# EAGLE design limitSwitch (EAGLE 9.6.2)
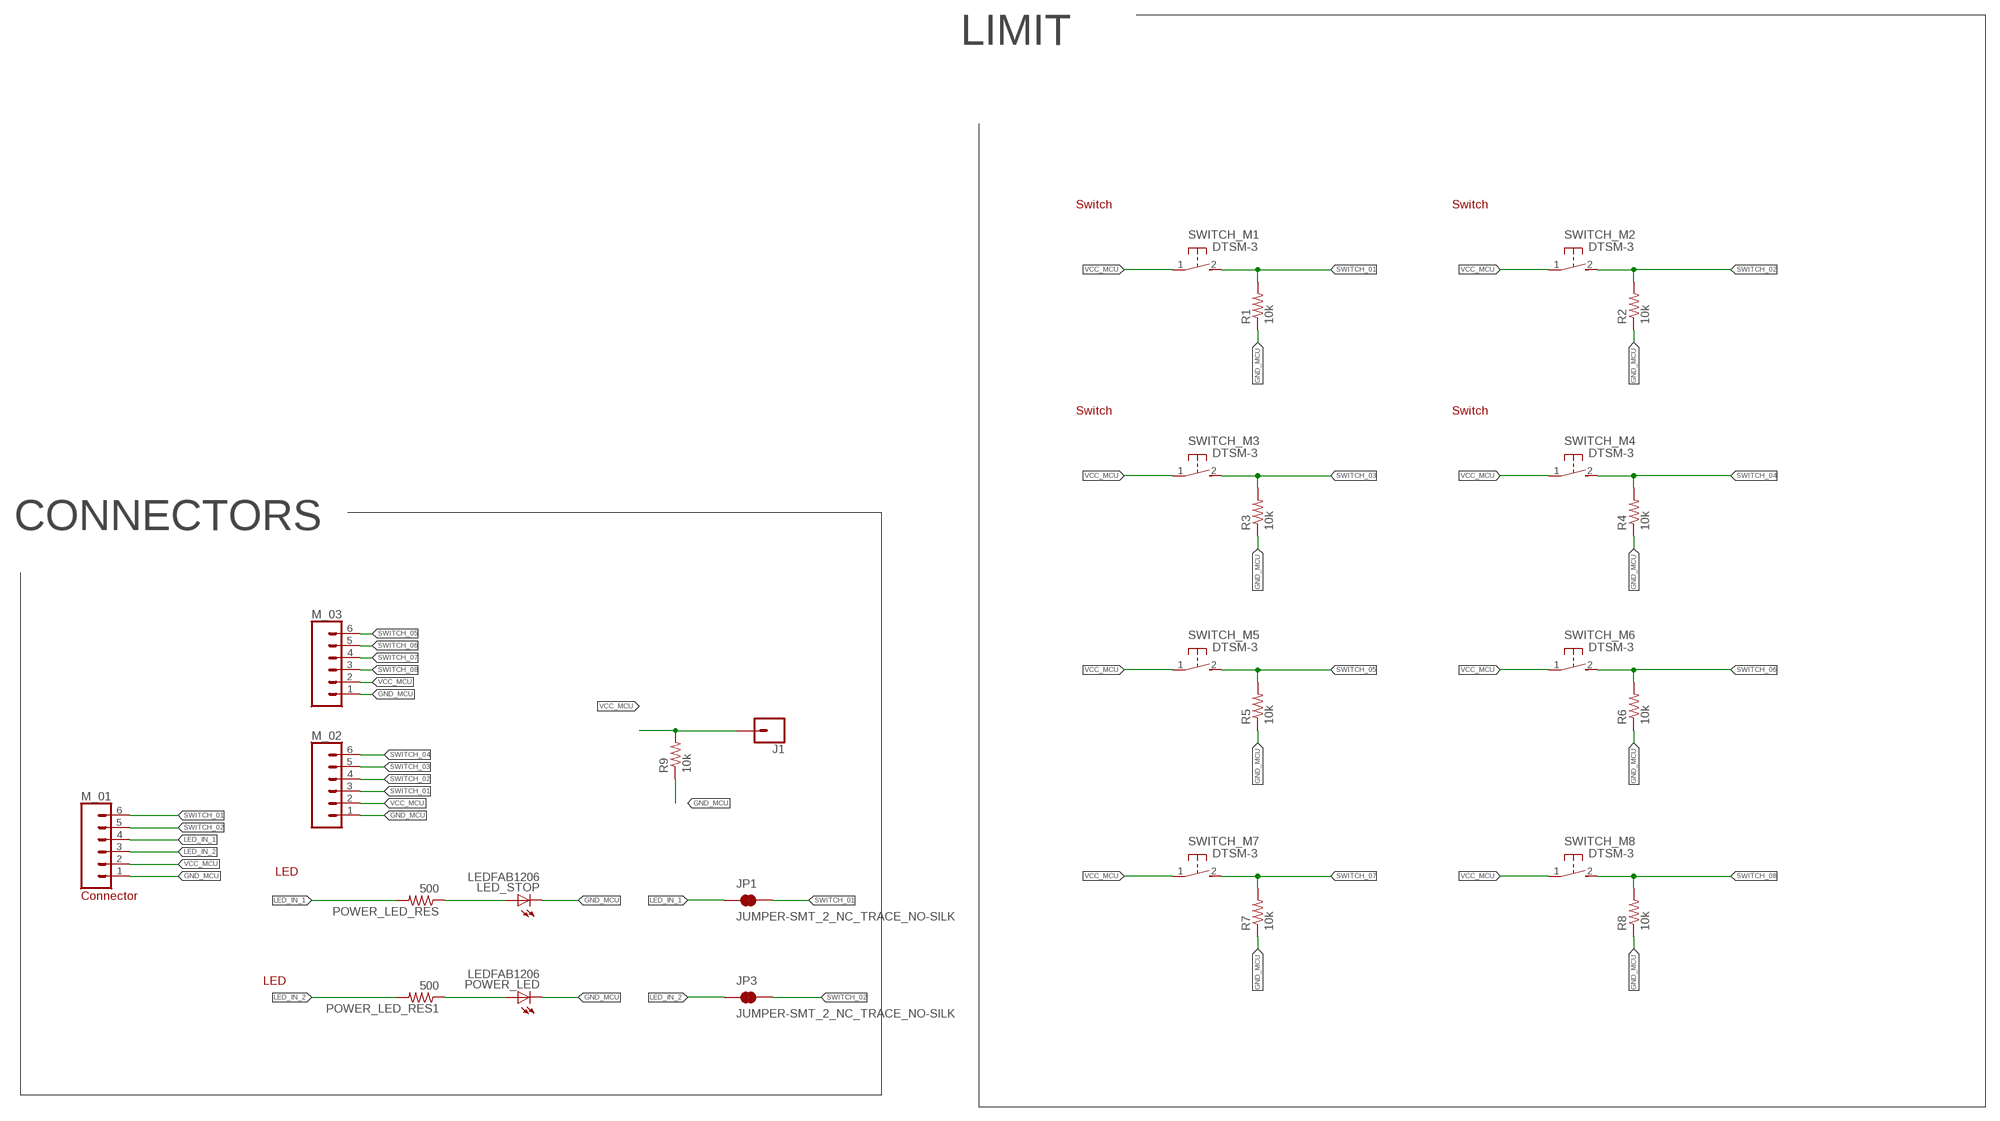
[diagram p0: schematic, sheet 1]

## Parts
J1  CONN_01  [1X01]
JP1  JUMPER-SMT_2_NC_TRACE_NO-SILK  [SMT-JUMPER_2_NC_TRACE_NO-SILK]
JP3  JUMPER-SMT_2_NC_TRACE_NO-SILK  [SMT-JUMPER_2_NC_TRACE_NO-SILK]
LED_STOP  LEDFAB1206  [LED1206FAB]
M_01  CONN_06SMD-1MM  [1X06-1MM]
M_02  CONN_06SMD-1MM  [1X06-1MM]
M_03  CONN_06SMD-1MM  [1X06-1MM]
POWER_LED  LEDFAB1206  [LED1206FAB]
POWER_LED_RES  500  R-US_M0805  [M0805]
POWER_LED_RES1  500  R-US_M0805  [M0805]
R1  10k  R-US_M0805  [M0805]
R2  10k  R-US_M0805  [M0805]
R3  10k  R-US_M0805  [M0805]
R4  10k  R-US_M0805  [M0805]
R5  10k  R-US_M0805  [M0805]
R6  10k  R-US_M0805  [M0805]
R7  10k  R-US_M0805  [M0805]
R8  10k  R-US_M0805  [M0805]
R9  10k  R-US_M0805  [M0805]
SWITCH_M1  DTSM-3  [DTSM-3]
SWITCH_M2  DTSM-3  [DTSM-3]
SWITCH_M3  DTSM-3  [DTSM-3]
SWITCH_M4  DTSM-3  [DTSM-3]
SWITCH_M5  DTSM-3  [DTSM-3]
SWITCH_M6  DTSM-3  [DTSM-3]
SWITCH_M7  DTSM-3  [DTSM-3]
SWITCH_M8  DTSM-3  [DTSM-3]

## Nets
GND_MCU: LED_STOP.2(C) M_01.1 M_02.1 M_03.1 POWER_LED.2(C) R1.1 R2.1 R3.1 R4.1 R5.1 R6.1 R7.1 R8.1 R9.1
LED_IN_1: JP1.1 M_01.4 POWER_LED_RES.2
LED_IN_2: JP3.1 M_01.3 POWER_LED_RES1.2
N$1: POWER_LED.1(A) POWER_LED_RES1.1
N$11: LED_STOP.1(A) POWER_LED_RES.1
SWITCH_01: JP1.2 M_01.6 M_02.3 R1.2 SWITCH_M1.2
SWITCH_02: JP3.2 M_01.5 M_02.4 R2.2 SWITCH_M2.2
SWITCH_03: M_02.5 R3.2 SWITCH_M3.2
SWITCH_04: M_02.6 R4.2 SWITCH_M4.2
SWITCH_05: M_03.6 R5.2 SWITCH_M5.2
SWITCH_06: M_03.5 R6.2 SWITCH_M6.2
SWITCH_07: M_03.4 R7.2 SWITCH_M7.2
SWITCH_08: M_03.3 R8.2 SWITCH_M8.2
VCC_MCU [New Class]: J1.1 M_01.2 M_02.2 M_03.2 R9.2 SWITCH_M1.1 SWITCH_M2.1 SWITCH_M3.1 SWITCH_M4.1 SWITCH_M5.1 SWITCH_M6.1 SWITCH_M7.1 SWITCH_M8.1

## Notes on the sheet
- LIMIT
- Switch | Switch
- Switch | Switch
- CONNECTORS
- LED
- Connector
- LED

## Library data of the parts
J1 = SparkFun-Connectors:CONN_01: Single connection point. Often used as Generic Header-pin footprint for 0.1 inch spaced/style header connections On any of the 0.1 inch spaced packages, you can populate with these: Break Away Headers - Straight <https://www.sparkfun.com/products/116> (PRT-00116) Break Away Male Headers - Right Angle <https://www.sparkfun.com/products/553> (PRT-00553) Female Headers <https://www.sparkfun.com/products/115> (PRT-00115) Break Away Headers - Machine Pin <https://www.sparkfun.com/products/117> (PRT-00117) Break Away Female Headers - Swiss Machine Pin <https://www.sparkfun.com/products/743> (PRT-00743) This device is also useful as a general connection point to wire up your design to another part of your project. Our various solder wires solder well into these plated through hole pads. Hook-Up Wire - Assortment (Stranded, 22 AWG) <https://www.sparkfun.com/products/11375> (PRT-11375) Hook-Up Wire - Assortment (Solid Core, 22 AWG) <https://www.sparkfun.com/products/11367> (PRT-11367) View the entire wire category on our website here <https://www.sparkfun.com/categories/141> Special notes: SMTSO-256-ET is a "flush mount" nut for a 4-40 screw. We mostly use this on specialty testbeds; it is a nice way to connect hardware to your PCB at an adjustable hieght. Also note, the SNAP packages are for using a snappable style connector. We sell a baggie of snaps and they are also used on two LilyPad designs: Snap Assortment - 30 pack (male and female) <https://www.sparkfun.com/products/11347> (DEV-11347) LilyPad Arduino SimpleSnap <https://www.sparkfun.com/products/10941> (DEV-10941) LilyPad SimpleSnap Protoboard <https://www.sparkfun.com/products/10940> (DEV-10940)
JP1 JP3 = SparkFun-Jumpers:JUMPER-SMT_2_NC_TRACE: Normally closed trace jumper This jumper has a trace between two pads so it's normally closed (NC). Use a razor knife to open the connection. For best results follow the IPC guidelines for cutting traces: Cutout at least 0.063 mm (0.005 in). Remove all loose material to clean up the cut area. Seal the cut with an approved epoxy. Reapply solder to reclose the connection.
LED_STOP POWER_LED = fab:LED: LED
M_01-M_03 = SparkFun-Connectors:CONN_06: Multi connection point. Often used as Generic Header-pin footprint for 0.1 inch spaced/style header connections On any of the 0.1 inch spaced packages, you can populate with these: Break Away Headers - Straight <https://www.sparkfun.com/products/116> (PRT-00116) Break Away Male Headers - Right Angle <https://www.sparkfun.com/products/553> (PRT-00553) Female Headers <https://www.sparkfun.com/products/115> (PRT-00115) Break Away Headers - Machine Pin <https://www.sparkfun.com/products/117> (PRT-00117) Break Away Female Headers - Swiss Machine Pin <https://www.sparkfun.com/products/743> (PRT-00743) Arduino Stackable Header - 6 Pin <https://www.sparkfun.com/products/9280> (PRT-09280) For SCREWTERMINALS and SPRING TERMINALS visit here: Screw Terimnals on SparkFun.com <https://www.sparkfun.com/search/results?term=Screw+Terminals> (5mm/3.5mm/2.54mm spacing) This device is also useful as a general connection point to wire up your design to another part of your project. Our various solder wires solder well into these plated through hole pads. Hook-Up Wire - Assortment (Stranded, 22 AWG) <https://www.sparkfun.com/products/11375> (PRT-11375) Hook-Up Wire - Assortment (Solid Core, 22 AWG) <https://www.sparkfun.com/products/11367> (PRT-11367) View the entire wire category on our website here <https://www.sparkfun.com/categories/141>; PROD_ID: CONN-08249; SF_ID: GPS-00579
POWER_LED_RES POWER_LED_RES1 R1-R9 = resistor:R-US_: RESISTOR, American symbol
SWITCH_M1-SWITCH_M8 = switch-tact:DTSM-3

## Net classes
0 default: width 0.2 mm, clearance 0.2 mm
1 New Class: width 0.4 mm, clearance 0.2 mm

## Board
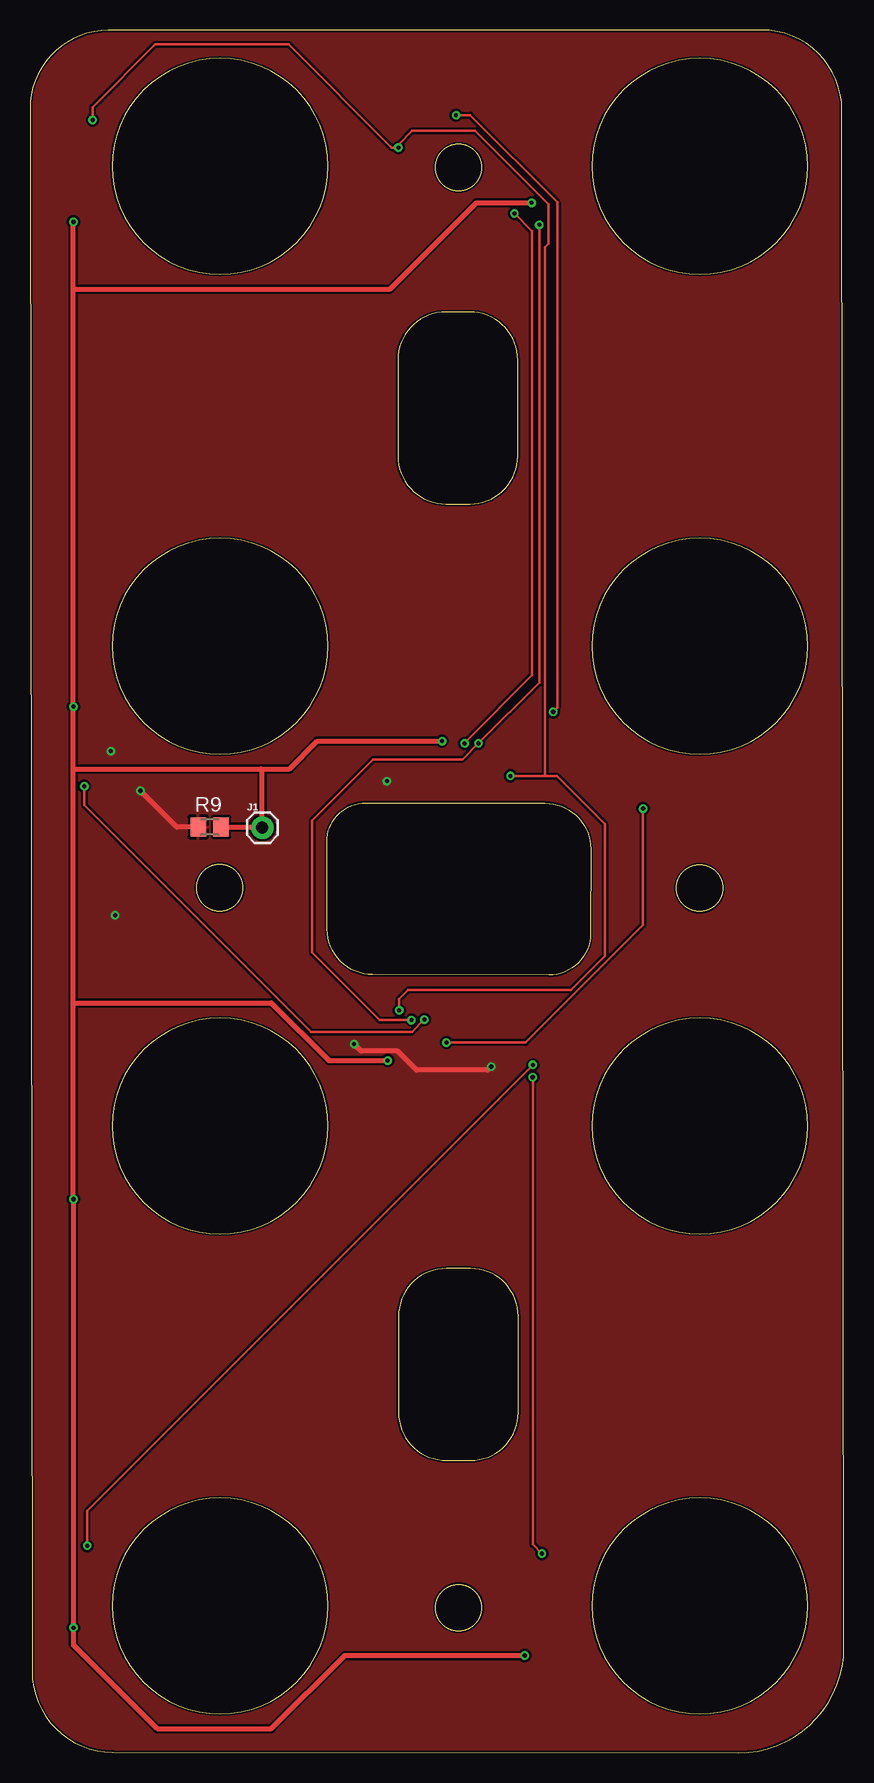
[diagram p1: board, top side]
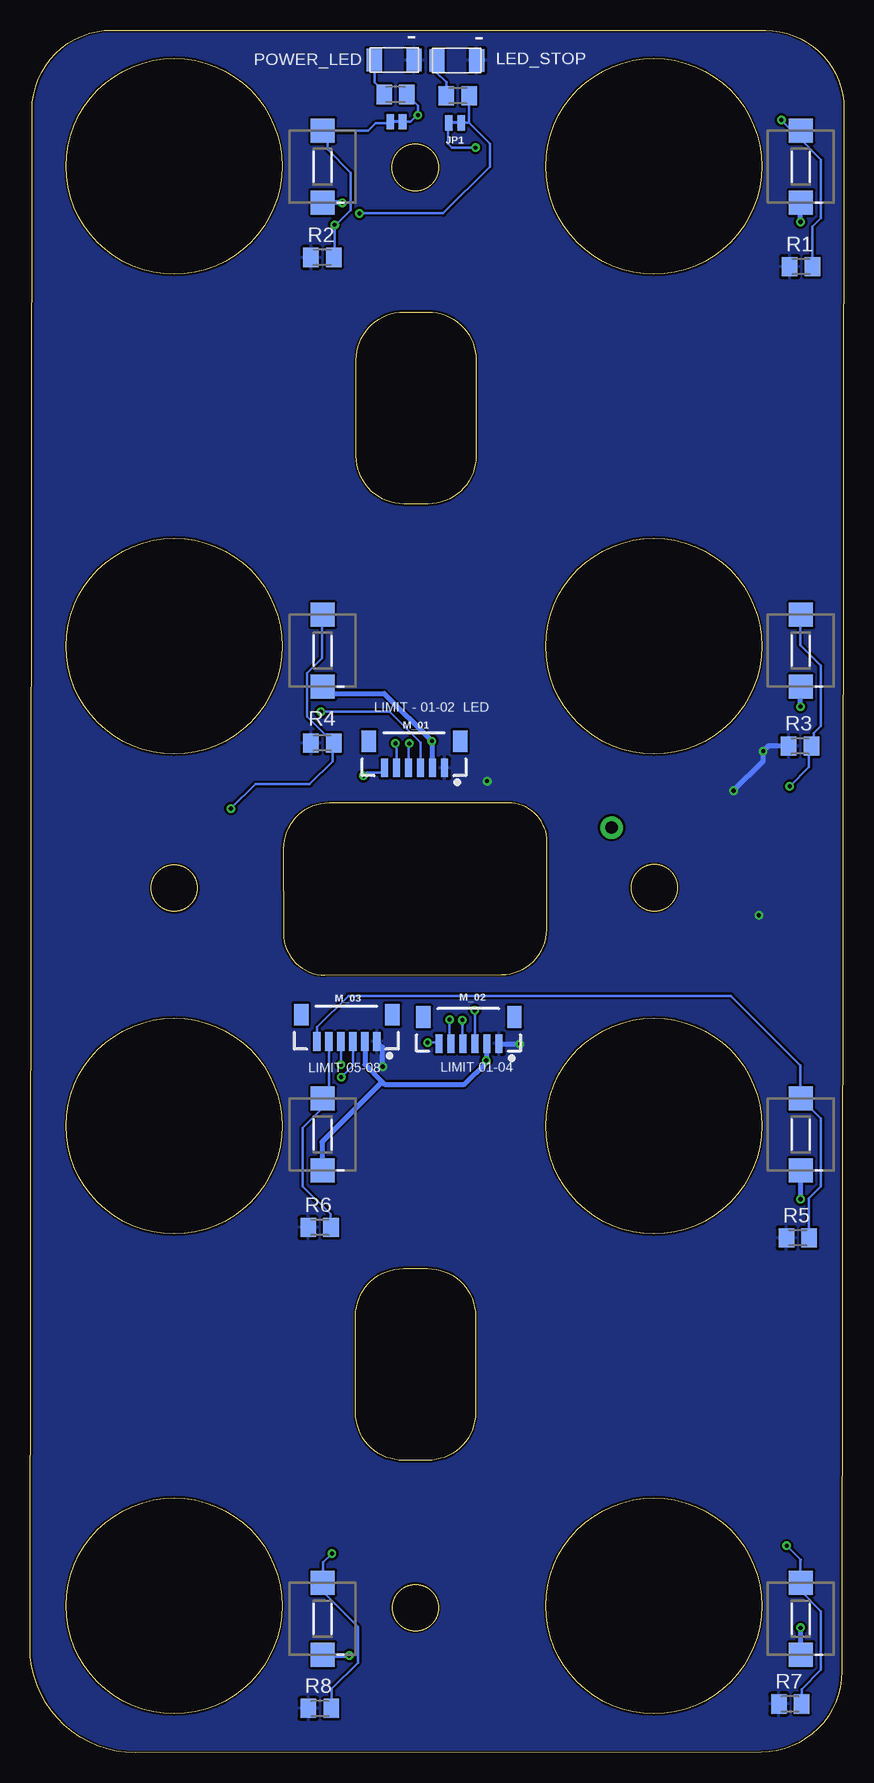
[diagram p2: board, bottom side, seen from below]

Size 67.87 x 143.61 mm. Coordinates in mm from the lower left corner, seen from the top.
Outline: 67.87,8.81 67.7,136.93 arc90 61.01,143.61 6.54,143.58 arc90 0,137.03 0.17,6.79 arc90 6.9,0.06 59.07,0 arc90 67.87,8.81
Outline: 15.85,123.25 arc180 15.85,141.25 arc180 15.85,123.25
Outline: 55.85,123.25 arc180 55.85,141.25 arc180 55.85,123.25
Outline: 55.85,83.25 arc180 55.85,101.25 arc180 55.85,83.25
Outline: 55.85,43.25 arc180 55.85,61.25 arc180 55.85,43.25
Outline: 55.85,3.25 arc180 55.85,21.25 arc180 55.85,3.25
Outline: 15.85,3.25 arc180 15.85,21.25 arc180 15.85,3.25
Outline: 15.85,43.25 arc180 15.85,61.25 arc180 15.85,43.25
Outline: 15.85,83.25 arc180 15.85,101.25 arc180 15.85,83.25
Outline: 27.98,79.17 42.95,79.16 arc-90 46.76,75.34 46.74,68.29 arc-90 43.26,64.83 28.57,64.86 arc-90 24.78,68.65 24.75,75.93 arc-90 27.98,79.17
Outline: 34.68,120.1 arc90 30.68,116.1 30.68,108.1 arc90 34.68,104.1 36.68,104.1 arc90 40.68,108.1 40.68,116.1 arc90 36.68,120.1 34.68,120.1
Outline: 36.72,40.38 34.72,40.38 arc90 30.72,36.38 30.72,28.38 arc90 34.72,24.38 36.72,24.38 arc90 40.72,28.38 40.72,36.38 arc90 36.72,40.38
Outline: circle at 15.82,72.11 radius 1.93
Outline: circle at 55.84,72.08 radius 1.93
Outline: circle at 35.74,12.1 radius 1.93
Outline: circle at 35.74,132.15 radius 1.93
Copper layers (1*16): Top 0.035mm / dielectric 1.5mm / Bottom 0.035mm
Design rules "SparkFun-2-Layer-General-JLCPCB": minimum track width 7mil, minimum drill 0.3mm, track to track 7mil, track to pad 7mil, pad to pad 7mil, via to via 7mil, smd to smd 7mil, copper to edge 7mil, drill to drill 7mil, minimum pad ring 7mil, minimum via ring 7mil, stop-mask expansion 3mil, vias tented up to drill 25mil, thermal gap 10mil

### Footprints (pad centres in the part's own frame; a part is rotated, then mirrored left to right if it is on the bottom)
1X01 = drill 1.016 pad 1.88: 1 0,0
SMT-JUMPER_2_NC_TRACE_NO-SILK = smd 0.635 x 1.27: 1 -0.508,0; 2 0.508,0
LED1206FAB = smd 1.27 x 1.905: 1 -1.651,0; 2 1.651,0
1X06-1MM = smd 0.6 x 1.55: 1 -2.54,1.27; 2 -1.54,1.27; 3 -0.54,1.27; 4 0.46,1.27; 5 1.46,1.27; 6 2.46,1.27 | smd 1.2 x 1.8: P$1 -3.84,-0.955; P$2 3.76,-0.955
M0805 = smd 1.3 x 1.6: 1 -0.95,0; 2 0.95,0
DTSM-3 = smd 2 x 2: 1 -3,0; 2 3,0

### Placement (x,y rotation side)
J1  19.37,77.13 0 top
JP1  32.44,135.87 180 bottom
JP3  37.32,135.97 180 bottom
LED_STOP  32.28,141.07 0 bottom
M_01  35.85,83.37 180 bottom
M_02  31.31,60.38 180 bottom
M_03  41.49,60.57 180 bottom
POWER_LED  37.5,141.11 0 bottom
POWER_LED_RES  32.21,138.12 0 bottom
POWER_LED_RES1  37.39,138.23 0 bottom
R1  3.58,123.87 0 bottom
R2  43.49,124.65 0 bottom
R3  3.67,83.92 0 bottom
R4  43.49,84.18 0 bottom
R5  3.85,42.91 0 bottom
R6  43.72,43.79 0 bottom
R7  4.48,4.07 0 bottom
R8  43.71,3.7 0 bottom
R9  14.98,77.16 0 top
SWITCH_M1  3.59,132.22 90 bottom
SWITCH_M2  43.47,132.22 90 bottom
SWITCH_M3  3.59,91.88 90 bottom
SWITCH_M4  43.47,91.88 90 bottom
SWITCH_M5  3.59,51.53 90 bottom
SWITCH_M6  43.47,51.53 90 bottom
SWITCH_M7  3.59,11.19 90 bottom
SWITCH_M8  43.47,11.19 90 bottom

### Tracks (layer width: path | path; a pad name or v marks a point on that pad's centre or on a via)
GND_MCU  (via drill 0.35)
  Top 0.4: R9.1 12.24,77.16 v9.21,80.2 | v27.03,59.08 27.61,58.49 30.65,58.49 32.24,56.91 38.17,56.91 v38.46,57.2
  Bottom 0.4: R3.1 6.31,83.93 v6.73,83.5 6.73,82.67 v9.21,80.2 | M_02.1 28.74,59.08 v27.03,59.08 | v38.46,57.2 38.46,58.8 M_03.1
  other vias: 7.1,69.81 29.76,81
  pour Top (isolate 0.005): -3.65,144.74 69.38,144.74 69.38,-1.73 -3.65,-1.73
  pour Bottom (isolate 0.005): -3.35,144.11 69.71,144.11 69.71,-5.06 -3.35,-5.06
LED_IN_1  (via drill 0.35)
  Top 0.2: v36.24,84.14 36.24,84.19 41.87,89.82 41.87,126.84 v40.4,128.32
  Bottom 0.2: POWER_LED_RES.2 31.26,135.87 JP1.1 | JP1.1 31.81,135.87 31.77,135.91 | v36.24,84.14 36.32,84.06 M_01.4 | v40.4,128.32 33.42,128.32 29.54,132.2 29.54,134.13 31.27,135.86 JP1.1
LED_IN_2  (via drill 0.35)
  Top 0.2: v43.62,86.78 43.96,87.11 43.96,129.25 36.71,136.51 v35.52,136.51
  Bottom 0.2: POWER_LED_RES1.2 35.5,137.28 35.5,136.59 35.55,136.54 | 35.55,136.54 36.12,135.97 JP3.1 | v43.62,86.78 37.91,86.78 35.32,84.19 M_01.3 | v35.52,136.51 35.55,136.54
N$1
  Bottom 0.2: POWER_LED_RES1.1 38.34,138.44 39.16,139.25 POWER_LED.1
N$11
  Bottom 0.2: POWER_LED_RES.1 33.16,139.24 34.04,140.13 34.04,140.96 LED_STOP.1
SWITCH_01  (via drill 0.35)
  Top 0.2: v30.78,61.88 30.78,62.86 31.53,63.61 45.12,63.61 47.92,66.41 47.92,77.41 43.92,81.41 42.92,81.41 42.92,81.43 | v40.06,81.43 42.92,81.43 | v5.22,136.11 5.22,137.19 10.44,142.41 21.57,142.41 30.17,133.81 v30.72,133.81 30.72,134.07 31.86,135.21 37.12,135.21 43.22,129.11 43.22,125.81 42.92,125.51 42.92,81.43
  Bottom 0.2: JP1.2 33.01,135.8 33.01,134.13 32.67,133.79 30.77,133.79 v30.72,133.81 | v30.78,61.88 30.78,59.13 M_02.3 | v40.06,81.43 39.79,81.71 38.52,81.71 38.22,82.01 M_01.6 | R1.2 2.62,123.91 2.62,127.21 1.92,127.91 1.92,132.81 3.52,134.41 3.52,135.21 SWITCH_M1.2 3.62,135.31 4.42,135.31 v5.22,136.11
SWITCH_02  (via drill 0.35)
  Top 0.2: v31.81,61.09 30.84,61.09 | 30.84,61.09 | 30.84,61.09 29.14,61.09 23.52,66.71 23.52,77.71 28.62,82.81 36.05,82.81 v37.4,84.15 42.47,89.23 v42.47,127.37
  Bottom 0.2: 37.61,136.3 37.65,136.26 37.65,136.15 JP3.2 | R2.2 42.47,124.92 v42.47,127.37 42.36,127.37 41.12,128.61 41.12,131.72 43.08,133.68 43.08,135.21 SWITCH_M2.2 39.67,135.22 39.06,135.83 38.05,135.83 37.87,136.01 JP3.2 | v31.81,61.09 31.81,59.18 M_02.4 | v37.4,84.15 37.32,84.08 M_01.5 | 37.88,136.35 37.94,136.28 37.94,136.33 | 37.88,136.35 37.83,136.4 | JP3.2 37.83,136.08 | JP3.2 37.83,136.3 37.88,136.35
SWITCH_03  (via drill 0.35)
  Top 0.2: v32.89,61.13 v32.87,61.13 31.84,60.09 23.44,60.09 4.52,79.01 v4.52,80.56
  Bottom 0.2: v32.89,61.13 32.89,59.33 M_02.5 | v4.52,80.56 2.92,82.16 2.92,83.71 2.72,83.91 R3.2 2.62,84.01 2.52,84.11 2.52,85.01 1.92,85.61 1.92,90.62 3.62,92.32 3.62,94.81 SWITCH_M3.2
SWITCH_04  (via drill 0.35)
  Top 0.2: v34.72,59.21 41.32,59.21 51.12,69.01 v51.12,78.71
  Bottom 0.2: v34.72,59.21 33.82,59.21 M_02.6 | v51.12,78.71 49.08,80.75 44.54,80.75 42.65,82.65 42.65,84.07 R4.2 44.77,86.4 44.77,90 43.52,91.25 43.52,94.81 SWITCH_M4.2
SWITCH_05
  Bottom 0.2: M_03.6 43.92,59.31 43.92,60.51 41.32,63.11 9.42,63.11 3.62,57.31 3.62,54.61 SWITCH_M5.2 3.52,54.51 3.52,54.49 1.92,52.89 1.92,47.21 2.92,46.21 2.92,43.01 R5.2
SWITCH_06
  Bottom 0.2: M_03.5 42.92,59.21 42.92,55.11 43.42,54.61 SWITCH_M6.2 43.52,54.51 43.52,53.71 45.12,52.11 45.12,47.21 42.82,44.91 42.82,43.81 R6.2
SWITCH_07  (via drill 0.35)
  Top 0.2: v41.94,57.34 4.77,20.18 v4.77,17.26
  Bottom 0.2: v41.94,57.34 41.94,59.24 M_03.4 | v4.77,17.26 3.61,16.1 3.62,16.1 3.62,14.21 SWITCH_M7.2 3.52,14.11 3.52,13.41 1.92,11.81 1.92,6.91 3.52,5.31 3.52,4.11 R7.2
SWITCH_08  (via drill 0.35)
  Top 0.2: v41.92,56.31 41.92,17.37 v42.69,16.6
  Bottom 0.2: v41.92,56.31 40.92,57.31 40.92,59.21 M_03.3 | v42.69,16.6 43.42,15.87 43.42,14.21 SWITCH_M8.2 43.42,14.11 43.42,13.41 40.53,10.51 40.53,7.52 42.72,5.33 42.72,3.71 R8.2
VCC_MCU  (via drill 0.35)
  Top 0.4: v41.26,8.11 41.24,8.09 26.21,8.09 20.12,2.01 10.61,2.01 3.62,9 v3.62,10.42 v3.62,46.15 3.62,62.51 | 3.62,62.51 3.62,82.01 | 3.62,82.01 v3.62,87.21 3.62,122.01 | 3.62,122.01 v3.62,127.61 | v41.82,129.21 37.22,129.21 30.02,122.01 3.62,122.01 | v29.82,57.71 24.92,57.71 20.12,62.51 3.62,62.51 | v34.36,84.33 23.95,84.33 21.63,82.01 19.25,82.01 | 3.62,82.01 19.25,82.01 | R9.2 19.33,77.16 J1.1 19.37,81.89 19.25,82.01
  Bottom 0.4: M_03.2 39.95,57.37 38.51,55.92 | 29.77,57.71 29.77,57.61 31.67,55.72 38.3,55.72 38.51,55.92 | 29.77,57.71 M_02.2 | M_01.2 34.36,82.14 v34.36,84.33 38.34,88.31 42.92,88.31 43.42,88.81 SWITCH_M4.1 | SWITCH_M6.1 43.52,48.61 43.52,50.91 38.62,55.81 38.51,55.92 | v3.62,10.42 3.62,8.21 SWITCH_M7.1 | v3.62,46.15 3.62,48.51 SWITCH_M5.1 | v41.26,8.11 43.42,8.11 SWITCH_M8.1 | v3.62,87.21 3.62,88.81 SWITCH_M3.1 | v3.62,127.61 3.62,129.21 SWITCH_M1.1 | v41.82,129.21 43.42,129.21 SWITCH_M2.1 | v29.82,57.71 29.77,57.71

### Text on the board
bPlace: - | -
bNames: LIMIT - 01-02 LED | LIMIT 01-04 | LIMIT 05-08